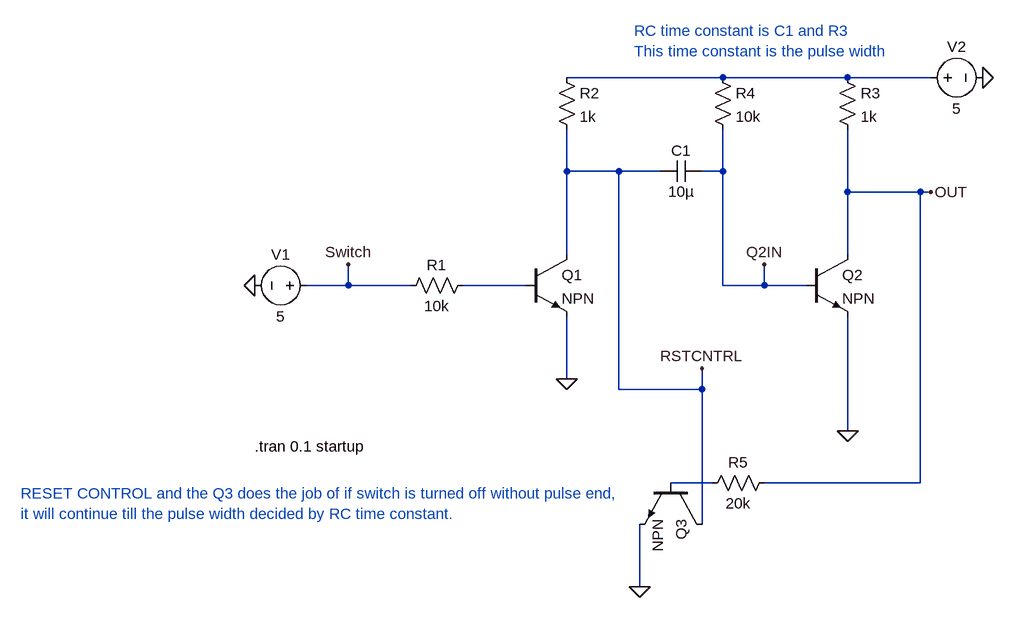
[diagram p0: schematic Pulse Generator_2.asc]
Pulse Generator_2.asc, the LTspice schematic file:
Version 4
SHEET 1 880 680
WIRE 352 -176 112 -176
WIRE 544 -176 352 -176
WIRE 672 -176 544 -176
WIRE 112 -32 112 -96
WIRE 192 -32 112 -32
WIRE 256 -32 192 -32
WIRE 352 -32 352 -96
WIRE 352 -32 320 -32
WIRE 544 0 544 -96
WIRE 656 0 544 0
WIRE 672 0 656 0
WIRE 112 96 112 -32
WIRE 544 96 544 0
WIRE -224 144 -224 112
WIRE -224 144 -288 144
WIRE -128 144 -224 144
WIRE 48 144 -48 144
WIRE 352 144 352 -32
WIRE 416 144 416 112
WIRE 416 144 352 144
WIRE 480 144 416 144
WIRE 112 288 112 192
WIRE 192 304 192 -32
WIRE 320 304 320 272
WIRE 320 304 192 304
WIRE 544 368 544 192
WIRE 336 448 272 448
WIRE 656 448 656 0
WIRE 656 448 416 448
WIRE 320 512 320 304
WIRE 224 608 224 512
FLAG 544 368 0
FLAG 112 288 0
FLAG -368 144 0
FLAG 752 -176 0
FLAG 672 0 OUT
FLAG 416 112 Q2IN
FLAG -224 112 Switch
FLAG 224 608 0
FLAG 320 272 RSTCNTRL
SYMBOL voltage -272 144 R90
WINDOW 0 -32 56 VBottom 2
WINDOW 3 32 56 VTop 2
WINDOW 123 0 0 Left 0
WINDOW 39 0 0 Left 0
SYMATTR InstName V1
SYMATTR Value 5
SYMBOL res -32 128 R90
WINDOW 0 0 56 VBottom 2
WINDOW 3 32 56 VTop 2
SYMATTR InstName R1
SYMATTR Value 10k
SYMBOL npn 48 96 R0
SYMATTR InstName Q1
SYMBOL cap 320 -48 R90
WINDOW 0 0 32 VBottom 2
WINDOW 3 32 32 VTop 2
SYMATTR InstName C1
SYMATTR Value 10µ
SYMBOL res 96 -192 R0
SYMATTR InstName R2
SYMATTR Value 1k
SYMBOL res 528 -192 R0
SYMATTR InstName R3
SYMATTR Value 1k
SYMBOL npn 480 96 R0
SYMATTR InstName Q2
SYMBOL res 336 -192 R0
SYMATTR InstName R4
SYMATTR Value 10k
SYMBOL voltage 656 -176 R270
WINDOW 0 32 56 VTop 2
WINDOW 3 -32 56 VBottom 2
WINDOW 123 0 0 Left 0
WINDOW 39 0 0 Left 0
SYMATTR InstName V2
SYMATTR Value 5
SYMBOL npn 320 448 R90
SYMATTR InstName Q3
SYMBOL res 432 432 R90
WINDOW 0 0 56 VBottom 2
WINDOW 3 32 56 VTop 2
SYMATTR InstName R5
SYMATTR Value 20k
TEXT -368 392 Left 2 !.tran 0.1 startup
TEXT 216 -248 Left 2 ;RC time constant is C1 and R3\nThis time constant is the pulse width
TEXT -728 464 Left 2 ;RESET CONTROL and the Q3 does the job of if switch is turned off without pulse end,\nit will continue till the pulse width decided by RC time constant.

The netlist it stands for:
* Pulse Generator_2.asc
V1 Switch 0 5
R1 N002 Switch 10k
Q1 RSTCNTRL N002 0 0 NPN
C1 Q2IN RSTCNTRL 10µ
R2 N001 RSTCNTRL 1k
R3 N001 OUT 1k
Q2 OUT Q2IN 0 0 NPN
R4 N001 Q2IN 10k
V2 N001 0 5
Q3 RSTCNTRL N003 0 0 NPN
R5 OUT N003 20k
.model NPN NPN
.model PNP PNP
.lib standard.bjt
.tran 0.1 startup
* RC time constant is C1 and R3
* This time constant is the pulse width
* RESET CONTROL and the Q3 does the job of if switch is turned off without pulse end,
* it will continue till the pulse width decided by RC time constant.
.backanno
.end